# Altium schematic sheet MCU.SchDoc
size 381 x 241 mm; SheetNumber: 1; SheetTotal: 5
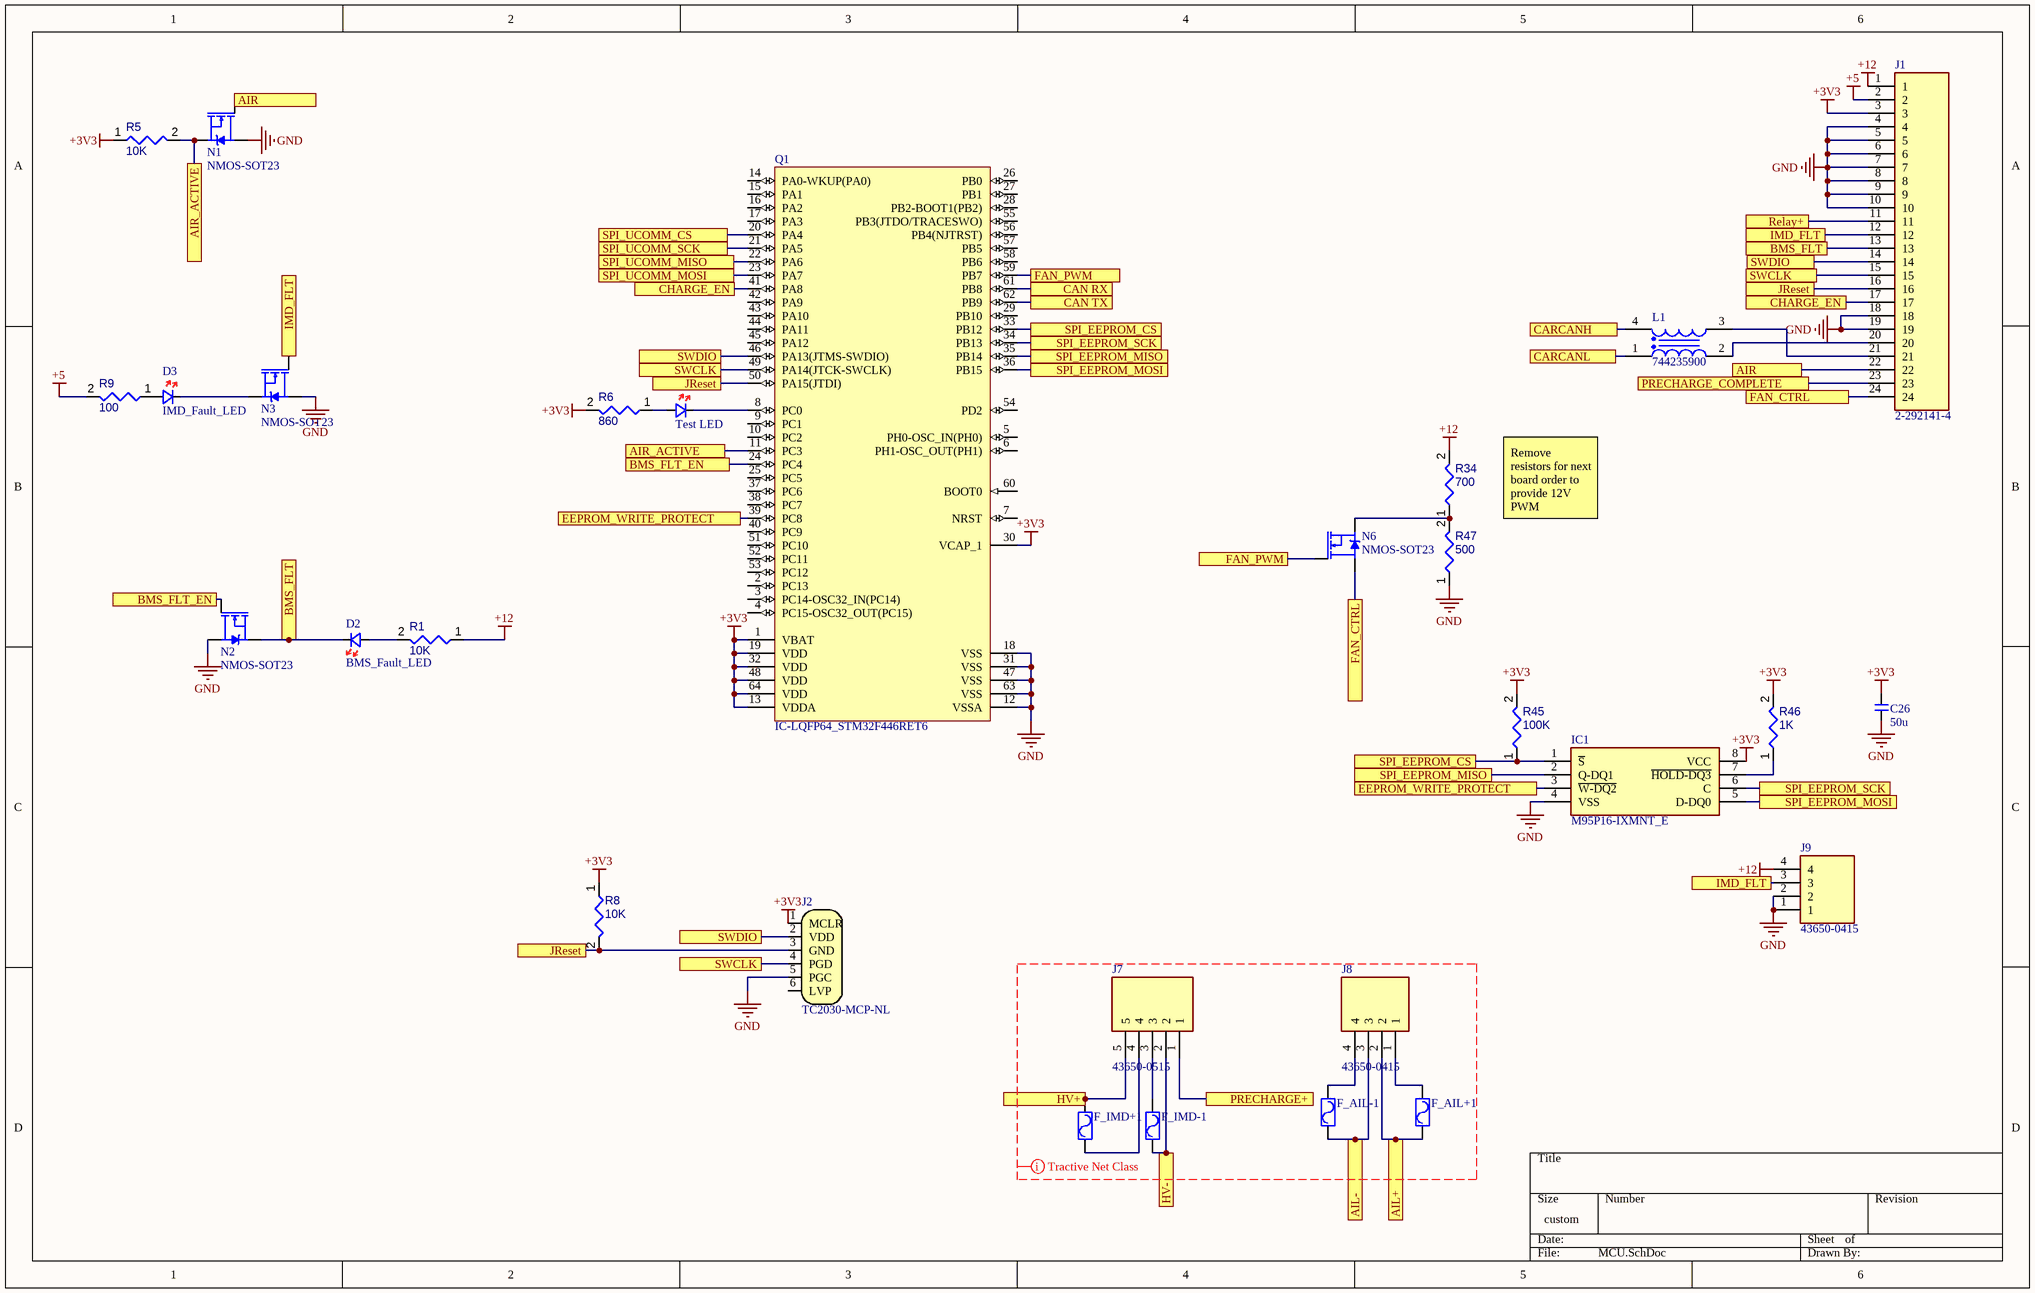
[diagram p0: MCU.SchDoc]

## Parts
C26  50u  [CAP-0603]
D1  Test LED  [LEDRED-0603]
D2  BMS_Fault_LED  [LEDRED-0603]
D3  IMD_Fault_LED  [LEDRED-0603]
F_AIL+1  (no value)  [FUSE_885]
F_AIL-1  (no value)  [FUSE_885]
F_IMD+1  (no value)  [FUSE_885]
F_IMD-1  (no value)  [FUSE_885]
IC1  M95P16-IXMNT_E  [SOIC127P600X175-8N]
J1  2-292141-4  [TE_2-292141-4]
J2  TC2030-MCP-NL  [TC2030-MCP-NL]  (no BOM)
J7  43650-0515  [43650-05YY_151617]
J8  43650-0415  [43650-04YY_151617]
J9  43650-0415  [43650-04YY_151617]
L1  744235900  [WE-CNSW_1812]
N1  NMOS-SOT23  [SOT23]
N2  NMOS-SOT23  [SOT23]
N3  NMOS-SOT23  [SOT23]
N6  NMOS-SOT23  [SOT23]
Q1  IC-LQFP64_STM32F446RET6  [TSQFP50P1200X1200X160-64N]
R1  10K  [RESC0805(2012)_L]
R5  10K  [RESC0805(2012)_L]
R6  860  [RESC0805(2012)_L]
R8  10K  [RESC0805(2012)_L]
R9  100  [RESC0805(2012)_L]
R34  700  [RESC0805(2012)_L]
R45  100K  [RESC0805(2012)_L]
R46  1K  [RESC0805(2012)_L]
R47  500  [RESC0805(2012)_L]

## Ports
AIL+, AIL-, AIR, AIR_ACTIVE, BMS_FLT, BMS_FLT_EN, CAN RX, CAN TX, CARCANH, CARCANL, CHARGE_EN, EEPROM_WRITE_PROTECT, FAN_CTRL, FAN_PWM, HV+, HV-, IMD_FLT, JReset, PRECHARGE+, PRECHARGE_COMPLETE, Relay+, SPI_EEPROM_CS, SPI_EEPROM_MISO, SPI_EEPROM_MOSI, SPI_EEPROM_SCK, SPI_UCOMM_CS, SPI_UCOMM_MISO, SPI_UCOMM_MOSI, SPI_UCOMM_SCK, SWCLK, SWDIO

## Nets
+3V3: C26.1 IC1.8(VCC) J1.3 J2.1(MCLR) Q1.1(VBAT) Q1.13(VDDA) Q1.19(VDD) Q1.30(VCAP_1) Q1.32(VDD) Q1.48(VDD) Q1.64(VDD) R5.1 R6.2 R8.1 R45.2 R46.2
+5: J1.2 R9.2
+12: J1.1 J9.4 R1.1 R34.2
GND: C26.2 IC1.4(VSS) J1.4 J1.5 J1.6 J1.7 J1.8 J1.9 J1.10 J1.18 J1.19 J2.5(PGC) J9.1 J9.2 N1.2(S) N2.2(S) N3.2(S) Q1.12(VSSA) Q1.18(VSS) Q1.31(VSS) Q1.47(VSS) Q1.63(VSS) R47.1
AIL+: F_AIL+1.2 J8.2 ; port AIL+
AIL-: F_AIL-1.2 J8.3 ; port AIL-
AIR: J1.22 N1.1(G) ; port AIR
AIR_ACTIVE: N1.3(D) Q1.11(PC3) R5.2 ; port AIR_ACTIVE
BMS_FLT: D2.K J1.13 N2.3(D) ; port BMS_FLT
BMS_FLT_EN: N2.1(G) Q1.24(PC4) ; port BMS_FLT_EN
CAN RX: Q1.61(PB8) ; port CAN RX
CAN TX: Q1.62(PB9) ; port CAN TX
CARCANH: L1.4 ; port CARCANH
CARCANL: L1.1 ; port CARCANL
CHARGE_EN: J1.17 Q1.41(PA8) ; port CHARGE_EN
EEPROM_WRITE_PROTECT: IC1.3(~{W-DQ2}) Q1.39(PC8) ; port EEPROM_WRITE_PROTECT
FAN_CTRL: J1.24 N6.2(S) ; port FAN_CTRL
FAN_PWM: N6.1(G) Q1.59(PB7) ; port FAN_PWM
HV+: F_IMD+1.1 J7.5 ; port HV+
HV-: F_IMD-1.2 J7.2 ; port HV-
IMD_FLT: J1.12 J9.3 N3.1(G) ; port IMD_FLT
JReset: J1.16 J2.3(GND) Q1.50(PA15(JTDI)) R8.2 ; port JReset
PRECHARGE+: J7.1 ; port PRECHARGE+
PRECHARGE_COMPLETE: J1.23 ; port PRECHARGE_COMPLETE
Relay+: J1.11 ; port Relay+
SPI_EEPROM_CS: IC1.1(~{S}) Q1.33(PB12) R45.1 ; port SPI_EEPROM_CS
SPI_EEPROM_MISO: IC1.2(Q-DQ1) Q1.35(PB14) ; port SPI_EEPROM_MISO
SPI_EEPROM_MOSI: IC1.5(D-DQ0) Q1.36(PB15) ; port SPI_EEPROM_MOSI
SPI_EEPROM_SCK: IC1.6(C) Q1.34(PB13) ; port SPI_EEPROM_SCK
SPI_UCOMM_CS: Q1.20(PA4) ; port SPI_UCOMM_CS
SPI_UCOMM_MISO: Q1.22(PA6) ; port SPI_UCOMM_MISO
SPI_UCOMM_MOSI: Q1.23(PA7) ; port SPI_UCOMM_MOSI
SPI_UCOMM_SCK: Q1.21(PA5) ; port SPI_UCOMM_SCK
SWCLK: J1.15 J2.4(PGD) Q1.49(PA14(JTCK-SWCLK)) ; port SWCLK
SWDIO: J1.14 J2.2(VDD) Q1.46(PA13(JTMS-SWDIO)) ; port SWDIO
NetD1_A: D1.A R6.1
NetD1_K: D1.K Q1.8(PC0)
NetD2_A: D2.A R1.2
NetD3_A: D3.A R9.1
NetD3_K: D3.K N3.3(D)
NetF_AIL+1_1: F_AIL+1.1 J8.1
NetF_AIL-1_1: F_AIL-1.1 J8.4
NetF_IMD+1_2: F_IMD+1.2 J7.4
NetF_IMD-1_1: F_IMD-1.1 J7.3
NetIC1_7: IC1.7(~{HOLD-DQ3}) R46.1
NetJ1_20: J1.20 L1.2
NetJ1_21: J1.21 L1.3
NetN6_3: N6.3(D) R34.1 R47.2

Not connected (* = marked no-connect by the designer): J2 6(LVP); Q1 2(PC13) 3(PC14-OSC32_IN(PC14)) 4(PC15-OSC32_OUT(PC15)) 5(PH0-OSC_IN(PH0)) 6(PH1-OSC_OUT(PH1)) 7(NRST) 9(PC1) 10(PC2) 14(PA0-WKUP(PA0)) 15(PA1) 16(PA2) 17(PA3) 25(PC5) 26(PB0) 27(PB1) 28(PB2-BOOT1(PB2)) 29(PB10) 37(PC6) 38(PC7) 40(PC9) 42(PA9) 43(PA10) 44(PA11) 45(PA12) 51(PC10) 52(PC11) 53(PC12) 54(PD2) 55(PB3(JTDO/TRACESWO)) 56(PB4(NJTRST)) 57(PB5) 58(PB6) 60(BOOT0)

## Layout directives
mark named Tractive Net Class: (no net found under the mark)

## Notes on the sheet
- Remove resistors for next board order to provide 12V PWM

## Library data of the parts
C26 = CMP-050-000018-1: Design Item ID: CAP-0603; Source: ife19_Elec_Library.SchLib
D1-D3 = CMP-056-000392-1: Design Item ID: LEDRED-0603; Source: ife19_Elec_Library.SchLib
F_AIL+1 F_AIL-1 F_IMD+1 F_IMD-1 = CMP-056-000380-1: Source: ife19_Elec_Library.SchLib; Design Item ID: FUSE_885
IC1 = M95P16-IXMNT_E: Integrated Circuit; Manufacturer_Name: STMicroelectronics; Manufacturer_Part_Number: M95P16-IXMNT/E; Datasheet Link: https://www.st.com/resource/en/datasheet/m95p16-i.pdf; Height: 1.75mm
J1 = CMP-069-000000-1: CT DOUBLE ROW ASSY V 24P W/BOS; Product_Type: Connector; Centerline_Pitch: 2 mm; MF: TE Connectivity; Number_of_Positions: 24; Pin Count: 24; EU_RoHS_Compliance: Compliant; MP: 2-292141-4; SnapEDA_Link: https://www.snapeda.com/parts/2-292141-4/TE%20Connectivity%20AMP%20Connectors/view-part/1405306/?ref=snap; Purchase-URL: https://pricing.snapeda.com/search/part/2-292141-4/?ref=eda; Check_prices: https://www.snapeda.com/parts/2-292141-4/TE%20Connectivity%20AMP%20Connectors/view-part/1405306/?ref=eda; Value: *; Component Type: Standard; Design Item ID: 2-292141-4; Package: None; Price: None; Availability: Good; Source: 2-292141-4.SchLib
J2 = CMP-003-000769-1: Conector par ICD; Design Item ID: TC2030-MCP-NL; Source: Image Pasted at 2021-10-31 17-08.SchLib
J7 = 43650-0515: Connector; Manufacturer_Name: Molex; Datasheet Link: https://www.molex.com/pdm_docs/sd/436500215_sd.pdf; Height: 9.9mm; Manufacturer_Part_Number: 43650-0515; Mouser Part Number: 538-43650-0515; Mouser Price/Stock: https://www.mouser.co.uk/ProductDetail/Molex/43650-0515?qs=c7V%252BsbZfmqunbm8ss0Kakw%3D%3D
J8 J9 = 43650-0415: Connector; Manufacturer_Name: Molex; Datasheet Link: https://www.molex.com/pdm_docs/sd/436500215_sd.pdf; Height: 9.9mm; Manufacturer_Part_Number: 43650-0415; Mouser Part Number: 538-43650-0415; Mouser Price/Stock: https://www.mouser.co.uk/ProductDetail/Molex/43650-0415?qs=GEJyObWCoZgrB2DNhHHwDQ%3D%3D
L1 = CMP-1372-00007-2: NexarPartId: 24746530; Core Material: Ferrite; Max DC Current: 2A; Number of Lines: 2; Voltage Rating (AC): 50V; Impedance: 90Ω; Voltage Rating: 60V; DC Resistance (DCR): 50mΩ; Inductance: 300nH; Tolerance: 25%; Height: 2.8mm; Mount: Surface Mount; Packaging: Digi-Reel®; Termination: SMD/SMT; Ambient Temperature Range Low: -40°C; REACH SVHC: No SVHC; Length: 4.5mm; Width: 3.2mm; Number of Pins: 4; Ambient Temperature Range High: 85°C; RoHS: Compliant; Depth: 3.2mm; Current: 2A; Voltage Rating (DC): 50V; Max Operating Temperature: 125°C; Case/Package: 1812; Min Operating Temperature: -40°C; Current Rating: 2A; Resistance: 50mΩ
N1-N3 N6 = CMP-056-000387-1: Source: ife19_Elec_Library.SchLib; Design Item ID: NMOS-SOT23
Q1 = CMP-056-000420-1: IC MCU 32BIT 512KB FLASH 64LQFP; Manufacturer: STMicroelectronics; Data Bus Width: 32b; Number of Programmable I/O: 50; Max Supply Voltage: 3.6V; Interface: CAN,EBI/EMI,I2C,I2S,IrDA,LIN,SD,SPI,UART,USART,USB; Max Frequency: 180MHz; Number of Timers/Counters: 14; Max Power Dissipation: 345mW; Core Architecture: ARM; RAM Size: 132KB; Watchdog Timer: Yes; Peripherals: Brown-out Detect/Reset,DMA,LVD,POR,PWM,WDT; Min Supply Voltage: 1.7V; Oscillator Type: Internal; Source: ife19_Elec_Library.SchLib; Packaging: Tray; Memory Size: 512KB; Min Operating Temperature: -40°C; Pricing 1: 1 = 8.59000, 10 = 7.76200, 160 = 6.42581, 640 = 5.59550, 1120 = 4.87350 (USD); Number of Pins: 64; Manufacturer Part Number: STM32F446RET6; Memory Type: FLASH; Mount: Surface Mount; Max Operating Temperature: 85°C; Frequency: 180MHz; Stock 1: 9529; REACH SVHC: No SVHC; Case/Package: LQFP; RoHS: Yes; Design Item ID: IC-LQFP64_STM32F446RET6; Number of I/Os: 50; Lead Free: Lead Free
R1 R5 R6 R8 R9 R34 R45-R47 = CMP-009-000150-1: Chip Resistor, 43,2 kOhms, +/-1 %, 63 mW, -55 to 155 degC, 0402; Available Preview Images: 2D; Source: Integrated_Library - 12.03.21 - 15.39.SchLib; Design Item ID: CMP-009-00154-2